# Altium schematic sheet Led_And_Sound.SchDoc
size A4
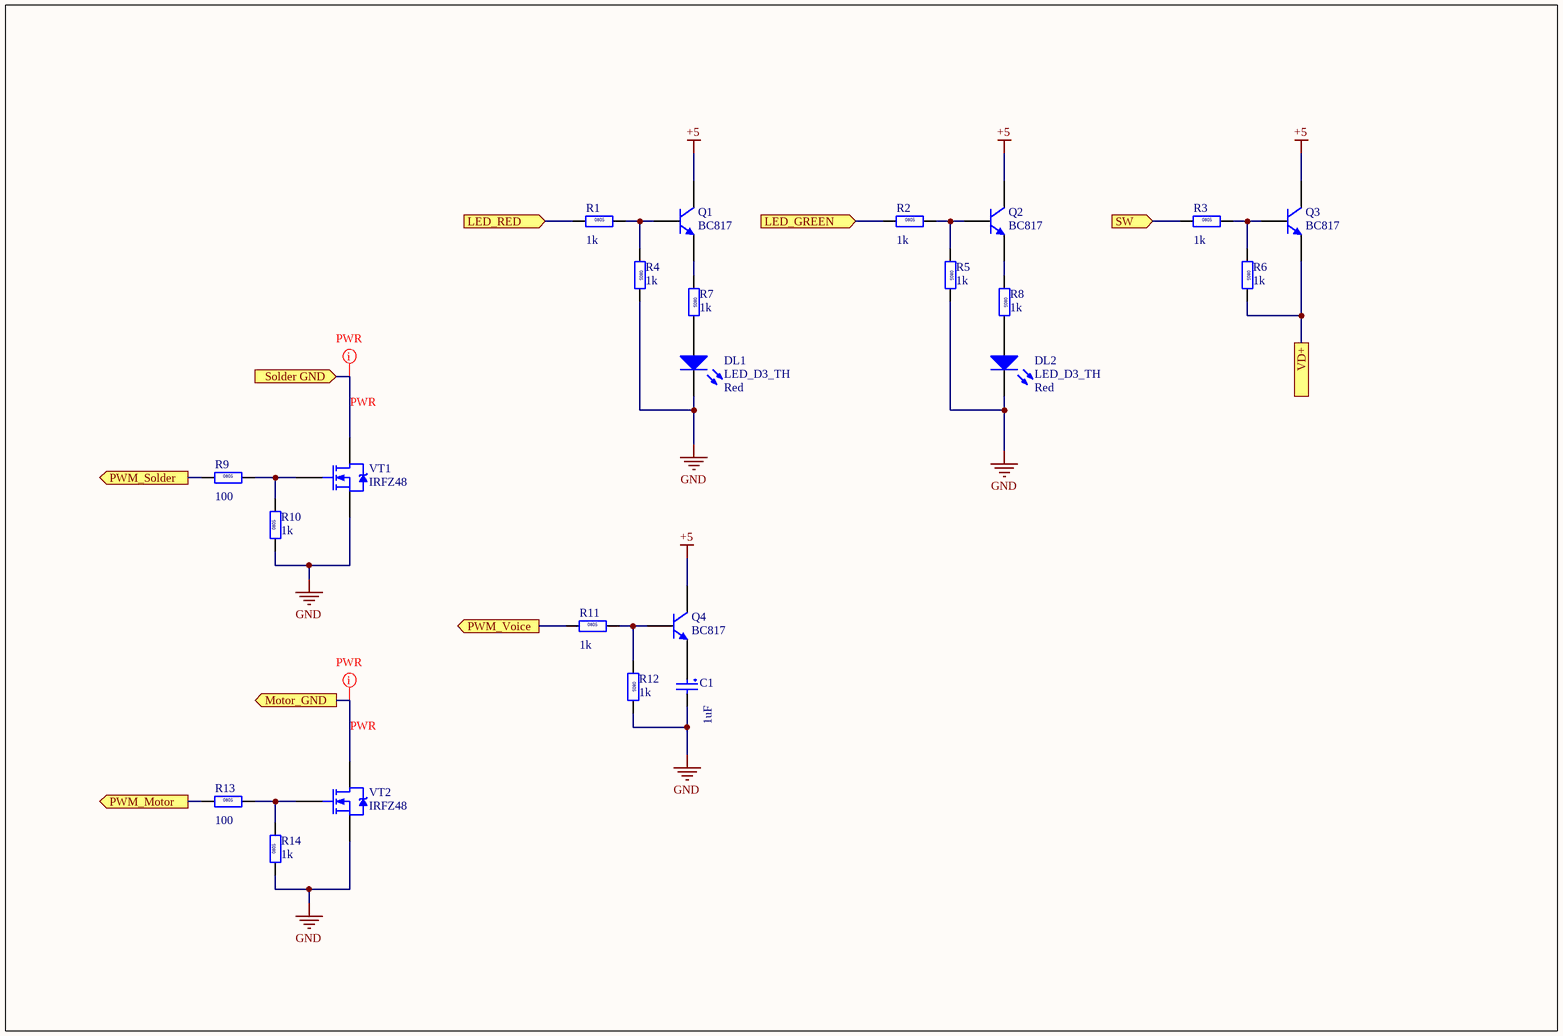
[diagram p0: Led_And_Sound.SchDoc]

## Parts
C1  value 1uF  [ECAP1325]  (hidden comment: ECAP-1325)
DL1  LED_D3_TH  value Red  [LED_D3_TH]
DL2  LED_D3_TH  value Red  [LED_D3_TH]
Q1  BC817  [SOT23-3M]
Q2  BC817  [SOT23-3M]
Q3  BC817  [SOT23-3M]
Q4  BC817  [SOT23-3M]
R1  value 1k  [RESC2012-0805M]  (hidden comment: RESC_0805_R)
R2  value 1k  [RESC2012-0805M]  (hidden comment: RESC_0805_R)
R3  value 1k  [RESC2012-0805M]  (hidden comment: RESC_0805_R)
R4  value 1k  [RESC2012-0805M]  (hidden comment: RESC_0805_R)
R5  value 1k  [RESC2012-0805M]  (hidden comment: RESC_0805_R)
R6  value 1k  [RESC2012-0805M]  (hidden comment: RESC_0805_R)
R7  value 1k  [RESC2012-0805M]  (hidden comment: RESC_0805_R)
R8  value 1k  [RESC2012-0805M]  (hidden comment: RESC_0805_R)
R9  value 100  [RESC2012-0805M]  (hidden comment: RESC_0805_R)
R10  value 1k  [RESC2012-0805M]  (hidden comment: RESC_0805_R)
R11  value 1k  [RESC2012-0805M]  (hidden comment: RESC_0805_R)
R12  value 1k  [RESC2012-0805M]  (hidden comment: RESC_0805_R)
R13  value 100  [RESC2012-0805M]  (hidden comment: RESC_0805_R)
R14  value 1k  [RESC2012-0805M]  (hidden comment: RESC_0805_R)
VT1  IRFZ48  [TO-220]
VT2  IRFZ48  [TO-220]

## Ports
LED_GREEN (in), LED_RED (in), Motor_GND (out), PWM_Motor (out), PWM_Solder (out), PWM_Voice (out), Solder GND (in), SW (in), VD+

## Nets
+5: Q1.3(C) Q2.3(C) Q3.3(C) Q4.3(C)
GND: C1.2 DL1.2(K) DL2.2(K) R4.2 R5.2 R10.1 R12.2 R14.1 VT1.3(S) VT2.3(S)
LED_GREEN: R2.1 ; port LED_GREEN
LED_RED: R1.1 ; port LED_RED
Motor_GND: VT2.2(D) ; port Motor_GND
PWM_Motor: R13.1 ; port PWM_Motor
PWM_Solder: R9.1 ; port PWM_Solder
PWM_Voice: R11.1 ; port PWM_Voice
Solder GND: VT1.2(D) ; port Solder GND
SW: R3.1 ; port SW
VD+: Q3.2(E) R6.2 ; port VD+
NetC1_1: C1.1 Q4.2(E)
NetDL1_1: DL1.1(A) R7.2
NetDL2_1: DL2.1(A) R8.2
NetQ1_1: Q1.1(B) R1.2 R4.1
NetQ1_2: Q1.2(E) R7.1
NetQ2_1: Q2.1(B) R2.2 R5.1
NetQ2_2: Q2.2(E) R8.1
NetQ3_1: Q3.1(B) R3.2 R6.1
NetQ4_1: Q4.1(B) R11.2 R12.1
NetR9_2: R9.2 R10.2 VT1.1(G)
NetR13_2: R13.2 R14.2 VT2.1(G)

## Layout directives
mark named PWR: Motor_GND, Solder GND

## Notes on the sheet
- PWR
- (in symbol RESC_0805_R) 0805

## Library data of the parts
C1 = ECAP-1325: Capacitor electrolytic 5 mm pitch, 13*25 body
DL1 DL2 = LED_D3_TH: LED Through hole D3mm
Q1-Q4 = BC817: BC817 NPN Transistor
R1-R14 = RESC_0805_R: Resistor 0805
VT1 VT2 = IRFZ48: HEXFET N-Channel Power MOSFET; Note: Pin 2 is electrically connected to pin 4.; Published: 8-Jun-2000; LatestRevisionDate: 17-Jul-2002; LatestRevisionNote: Re-released for DXP Platform.; DatasheetVersion: PD-9.758; PackageVersion: Feb-1997; PackageReference: TO-220AB; Publisher: Altium Limited; PackageDescription: TO, Thru-Hole, Vertical, Heatsink Mounted; 3 In-Line Leads; Pitch 2.54 mm; ComponentLink1Description: Manufacturer Link; ComponentLink1URL: http://www.irf.com/; ComponentLink2Description: Datasheet; ComponentLink2URL: http://www.irf.com/product-info/datasheets/data/irfz48.pdf